# Altium project 407I.PrjPcb
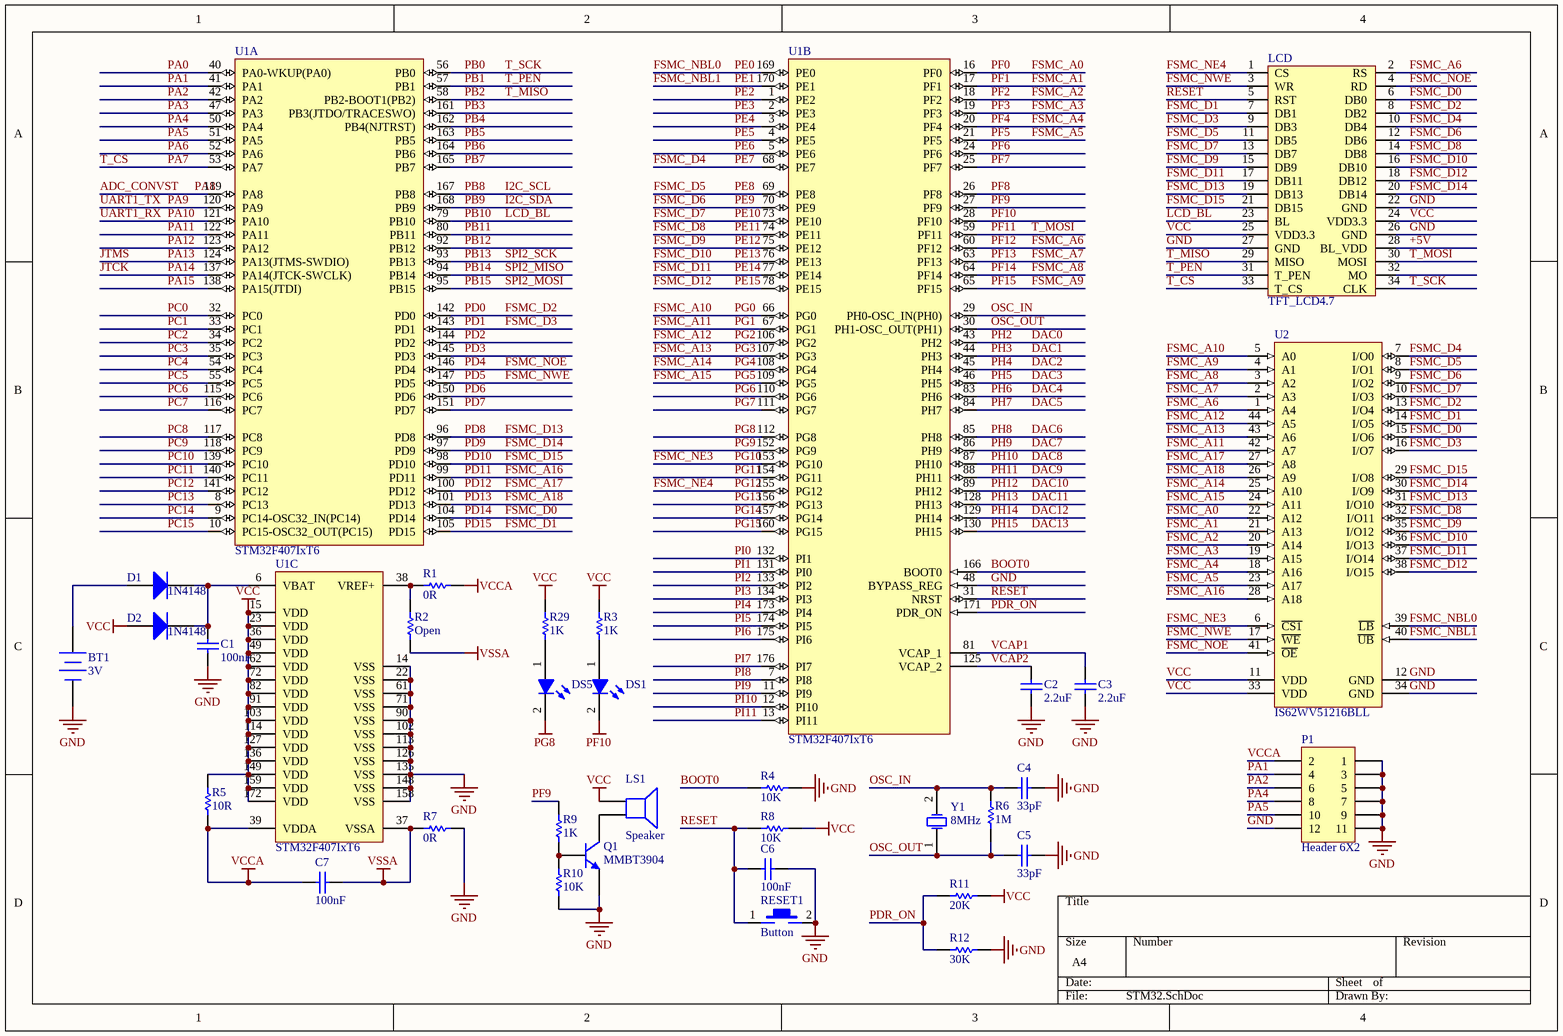
[diagram p0: STM32.SchDoc]
4 sheets, 101 parts. Net scope: global (net labels, ports and power ports of the same name join across sheets).
Board file: F407I.PcbDoc
Sheets:
  STM32.SchDoc
  PORTS.SchDoc
  Power.SchDoc
  CLASS.SchDoc

## Sheet STM32.SchDoc
size A4

### Parts
BT1  3V  [BAT-2]
C1  100nF  [CAPC0603(1608)55_M]
C2  2.2uF  [CAPC0603(1608)55_M]
C3  2.2uF  [CAPC0603(1608)55_M]
C4  33pF  [CAPC0603(1608)55_M]
C5  33pF  [CAPC0603(1608)55_M]
C6  100nF  [CAPC0603(1608)55_M]
C7  100nF  [CAPC0603(1608)55_M]
D1  1N4148  [LL34]
D2  1N4148  [LL34]
DS1  LED-BLUE  [0603LED_BLUE_V]  (value not drawn)
DS5  LED-BLUE  [0603LED_BLUE_V]  (value not drawn)
LCD  TFT_LCD4.7  [DB2*17-3.5]
LS1  Speaker  [Buzzer]
P1  Header 6X2  [HDR2X6]
Q1  MMBT3904  [SOT23_M]
R1  0R  [RESC0603(1608)_M]
R2  Open  [RESC0603(1608)_M]
R3  1K  [RESC0603(1608)_M]
R4  10K  [RESC0603(1608)_M]
R5  10R  [RESC0603(1608)_M]
R6  1M  [RESC0603(1608)_M]
R7  0R  [RESC0603(1608)_M]
R8  10K  [RESC0603(1608)_M]
R9  1K  [RESC0603(1608)_M]
R10  10K  [RESC0603(1608)_M]
R11  20K  [RESC0603(1608)_M]
R12  30K  [RESC0603(1608)_M]
R29  1K  [RESC0603(1608)_M]
RESET1  Button  [Button665]
U1  STM32F407IxT6  [LQFP176]  (parts A,B,C of 3)
U2  IS62WV51216BLL  [TSOP-2-44]
Y1  8MHz  [HC-49S]

### Nets
+5V: LCD.28(BL_VDD)
GND: BT1.2(-) C1.2 C2.1 C3.1 C4.2 C5.2 C6.2 LCD.22(GND) LCD.26(GND) LCD.27(GND) P1.1 P1.3 P1.5 P1.7 P1.9 P1.11 P1.12 Q1.2(E) R4.1 R7.1 R10.1 R12.1 RESET1.2 U1.14(VSS) U1.22(VSS) U1.48(BYPASS_REG) U1.61(VSS) U1.71(VSS) U1.90(VSS) U1.102(VSS) U1.113(VSS) U1.126(VSS) U1.135(VSS) U1.148(VSS) U1.158(VSS) U2.12(GND) U2.34(GND)
PF10: DS1.2(K) U1.28(PF10)
PG8: DS5.2(K) U1.112(PG8)
VCC: D2.2(A) LCD.24(VDD3.3) LCD.25(VDD3.3) LS1.1 R3.2 R5.2 R8.1 R11.1 R29.2 U1.15(VDD) U1.23(VDD) U1.36(VDD) U1.49(VDD) U1.62(VDD) U1.72(VDD) U1.82(VDD) U1.91(VDD) U1.103(VDD) U1.114(VDD) U1.127(VDD) U1.136(VDD) U1.149(VDD) U1.159(VDD) U1.172(VDD) U2.11(VDD) U2.33(VDD)
VCCA: C7.1 P1.2 R1.1 R5.1 U1.39(VDDA)
VSSA: C7.2 R2.1 R7.2 U1.37(VSSA)
ADC_CONVST: U1.119(PA8)  [also labelled PA8]
BOOT0: R4.2 U1.166(BOOT0)
DAC0: U1.43(PH2)  [also labelled PH2]
DAC1: U1.44(PH3)  [also labelled PH3]
DAC2: U1.45(PH4)  [also labelled PH4]
DAC3: U1.46(PH5)  [also labelled PH5]
DAC4: U1.83(PH6)  [also labelled PH6]
DAC5: U1.84(PH7)  [also labelled PH7]
DAC6: U1.85(PH8)  [also labelled PH8]
DAC7: U1.86(PH9)  [also labelled PH9]
DAC8: U1.87(PH10)  [also labelled PH10]
DAC9: U1.88(PH11)  [also labelled PH11]
DAC10: U1.89(PH12)  [also labelled PH12]
DAC11: U1.128(PH13)  [also labelled PH13]
DAC12: U1.129(PH14)  [also labelled PH14]
DAC13: U1.130(PH15)  [also labelled PH15]
FSMC_A0: U1.16(PF0) U2.22(A12)  [also labelled PF0]
FSMC_A1: U1.17(PF1) U2.21(A13)  [also labelled PF1]
FSMC_A2: U1.18(PF2) U2.20(A14)  [also labelled PF2]
FSMC_A3: U1.19(PF3) U2.19(A15)  [also labelled PF3]
FSMC_A4: U1.20(PF4) U2.18(A16)  [also labelled PF4]
FSMC_A5: U1.21(PF5) U2.23(A17)  [also labelled PF5]
FSMC_A6: LCD.2(RS) U1.60(PF12) U2.1(A4)  [also labelled PF12]
FSMC_A7: U1.63(PF13) U2.2(A3)  [also labelled PF13]
FSMC_A8: U1.64(PF14) U2.3(A2)  [also labelled PF14]
FSMC_A9: U1.65(PF15) U2.4(A1)  [also labelled PF15]
FSMC_A10: U1.66(PG0) U2.5(A0)  [also labelled PG0]
FSMC_A11: U1.67(PG1) U2.42(A7)  [also labelled PG1]
FSMC_A12: U1.106(PG2) U2.44(A5)  [also labelled PG2]
FSMC_A13: U1.107(PG3) U2.43(A6)  [also labelled PG3]
FSMC_A14: U1.108(PG4) U2.25(A10)  [also labelled PG4]
FSMC_A15: U1.109(PG5) U2.24(A11)  [also labelled PG5]
FSMC_A16: U1.99(PD11) U2.28(A18)  [also labelled PD11]
FSMC_A17: U1.100(PD12) U2.27(A8)  [also labelled PD12]
FSMC_A18: U1.101(PD13) U2.26(A9)  [also labelled PD13]
FSMC_D0: LCD.6(DB0) U1.104(PD14) U2.15(I/O6)  [also labelled PD14]
FSMC_D1: LCD.7(DB1) U1.105(PD15) U2.14(I/O5)  [also labelled PD15]
FSMC_D2: LCD.8(DB2) U1.142(PD0) U2.13(I/O4)  [also labelled PD0]
FSMC_D3: LCD.9(DB3) U1.143(PD1) U2.16(I/O7)  [also labelled PD1]
FSMC_D4: LCD.10(DB4) U1.68(PE7) U2.7(I/O0)  [also labelled PE7]
FSMC_D5: LCD.11(DB5) U1.69(PE8) U2.8(I/O1)  [also labelled PE8]
FSMC_D6: LCD.12(DB6) U1.70(PE9) U2.9(I/O2)  [also labelled PE9]
FSMC_D7: LCD.13(DB7) U1.73(PE10) U2.10(I/O3)  [also labelled PE10]
FSMC_D8: LCD.14(DB8) U1.74(PE11) U2.32(I/O11)  [also labelled PE11]
FSMC_D9: LCD.15(DB9) U1.75(PE12) U2.35(I/O12)  [also labelled PE12]
FSMC_D10: LCD.16(DB10) U1.76(PE13) U2.36(I/O13)  [also labelled PE13]
FSMC_D11: LCD.17(DB11) U1.77(PE14) U2.37(I/O14)  [also labelled PE14]
FSMC_D12: LCD.18(DB12) U1.78(PE15) U2.38(I/O15)  [also labelled PE15]
FSMC_D13: LCD.19(DB13) U1.96(PD8) U2.31(I/O10)  [also labelled PD8]
FSMC_D14: LCD.20(DB14) U1.97(PD9) U2.30(I/O9)  [also labelled PD9]
FSMC_D15: LCD.21(DB15) U1.98(PD10) U2.29(I/O8)  [also labelled PD10]
FSMC_NBL0: U1.169(PE0) U2.39(~{LB})  [also labelled PE0]
FSMC_NBL1: U1.170(PE1) U2.40(~{UB})  [also labelled PE1]
FSMC_NE3: U1.153(PG10) U2.6(~{CS1})  [also labelled PG10]
FSMC_NE4: LCD.1(CS) U1.155(PG12)  [also labelled PG12]
FSMC_NOE: LCD.4(RD) U1.146(PD4) U2.41(~{OE})  [also labelled PD4]
FSMC_NWE: LCD.3(WR) U1.147(PD5) U2.17(~{WE})  [also labelled PD5]
I2C_SCL: U1.167(PB8)  [also labelled PB8]
I2C_SDA: U1.168(PB9)  [also labelled PB9]
JTCK: U1.137(PA14(JTCK-SWCLK))  [also labelled PA14]
JTMS: U1.124(PA13(JTMS-SWDIO))  [also labelled PA13]
LCD_BL: LCD.23(BL) U1.79(PB10)  [also labelled PB10]
OSC_IN: C4.1 R6.2 U1.29(PH0-OSC_IN(PH0)) Y1.2(OSC2)
OSC_OUT: C5.1 R6.1 U1.30(PH1-OSC_OUT(PH1)) Y1.1(OSC1)
PA0: U1.40(PA0-WKUP(PA0))
PA1: P1.4 U1.41(PA1)
PA2: P1.6 U1.42(PA2)
PA3: U1.47(PA3)
PA4: P1.8 U1.50(PA4)
PA5: P1.10 U1.51(PA5)
PA6: U1.52(PA6)
PA7: LCD.33(T_CS) U1.53(PA7)  [also labelled T_CS]
PA9: U1.120(PA9)  [also labelled UART1_TX]
PA10: U1.121(PA10)  [also labelled UART1_RX]
PA11: U1.122(PA11)
PA12: U1.123(PA12)
PA15: U1.138(PA15(JTDI))
PB0: LCD.34(CLK) U1.56(PB0)  [also labelled T_SCK]
PB1: LCD.31(T_PEN) U1.57(PB1)  [also labelled T_PEN]
PB2: LCD.29(MISO) U1.58(PB2-BOOT1(PB2))  [also labelled T_MISO]
PB3: U1.161(PB3(JTDO/TRACESWO))  [project net DDS_SCLK]
PB4: U1.162(PB4(NJTRST))  [project net DDS_CS]
PB5: U1.163(PB5)  [project net DDS_UP]
PB6: U1.164(PB6)  [project net DDS_P3]
PB7: U1.165(PB7)  [project net DDS_P2]
PB11: U1.80(PB11)
PB12: U1.92(PB12)
PB13: U1.93(PB13)  [also labelled SPI2_SCK]
PB14: U1.94(PB14)  [also labelled SPI2_MISO]
PB15: U1.95(PB15)  [also labelled SPI2_MOSI]
PC0: U1.32(PC0)
PC1: U1.33(PC1)
PC2: U1.34(PC2)
PC3: U1.35(PC3)
PC4: U1.54(PC4)
PC5: U1.55(PC5)
PC6: U1.115(PC6)
PC7: U1.116(PC7)
PC8: U1.117(PC8)
PC9: U1.118(PC9)
PC10: U1.139(PC10)
PC11: U1.140(PC11)
PC12: U1.141(PC12)
PC13: U1.8(PC13)
PC14: U1.9(PC14-OSC32_IN(PC14))
PC15: U1.10(PC15-OSC32_OUT(PC15))
PD2: U1.144(PD2)
PD3: U1.145(PD3)
PD6: U1.150(PD6)
PD7: U1.151(PD7)
PDR_ON: R11.2 R12.2 U1.171(PDR_ON)
PE2: U1.1(PE2)  [project net DDS_RESET]
PE3: U1.2(PE3)  [project net DDS_SDIO2]
PE4: U1.3(PE4)  [project net DDS_SDIO3]
PE5: U1.4(PE5)  [project net DDS_SDIO0]
PE6: U1.5(PE6)  [project net DDS_SDIO1]
PF6: U1.24(PF6)  [project net DDS_P1]
PF7: U1.25(PF7)  [project net DDS_P0]
PF8: U1.26(PF8)
PF9: R9.2 U1.27(PF9)
PF11: LCD.30(MOSI) U1.59(PF11)  [also labelled T_MOSI]
PG6: U1.110(PG6)
PG7: U1.111(PG7)
PG9: U1.152(PG9)
PG11: U1.154(PG11)
PG13: U1.156(PG13)
PG14: U1.157(PG14)
PG15: U1.160(PG15)
PI0: U1.132(PI1)
PI1: U1.131(PI0)
PI2: U1.133(PI2)
PI3: U1.134(PI3)
PI4: U1.173(PI4)
PI5: U1.174(PI5)
PI6: U1.175(PI6)
PI7: U1.176(PI7)
PI8: U1.7(PI8)
PI9: U1.11(PI9)
PI10: U1.12(PI10)
PI11: U1.13(PI11)
RESET: C6.1 LCD.5(RST) R8.2 RESET1.1 U1.31(NRST)
VCAP1: C3.2 U1.81(VCAP_1)
VCAP2: C2.2 U1.125(VCAP_2)
NetBT1_1: BT1.1(+) D1.2(A)
NetC1_1: C1.1 D1.1(K) D2.1(K) U1.6(VBAT)
NetDS1_1: DS1.1(A) R3.1
NetDS5_1: DS5.1(A) R29.1
NetLS1_2: LS1.2 Q1.3(C)
NetQ1_1: Q1.1(B) R9.1 R10.2
NetR1_2: R1.2 R2.2 U1.38(VREF+)

Not connected (* = marked no-connect by the designer): LCD 32(MO)

### Library data of the parts
BT1 = Battery: Multicell Battery; Published: 24-Mar-1999; LatestRevisionDate: 17-Jul-2002; LatestRevisionNote: Re-released for DXP Platform.; PackageReference: BAT-2; Publisher: Altium Limited; PackageDescription: Battery; 2 Leads
C1-C7 = CAP
D1 D2 = Diode: pin to pad: 1>2 2>1
LS1 = Speaker: Loudspeaker; Published: 24-Mar-1999; LatestRevisionDate: 17-Jul-2002; LatestRevisionNote: Re-released for DXP Platform.; PackageReference: PIN2; Publisher: Altium Limited
P1 = Header 6X2: Header, 6-Pin, Dual row; LatestRevisionDate: 17-Jul-2002; LatestRevisionNote: Re-released for DXP Platform.; Publisher: Altium Limited
Q1 = MMBT3904: NPN General Purpose Amplifier; Published: 8-Jun-2000; LatestRevisionDate: 15-Jan-2003; LatestRevisionNote: PCB Footprint 'BCY-W3/D4.7' replaced; DatasheetVersion: 1997; PackageVersion: Sep-1998; PackageReference: TO-92A; Publisher: Altium Limited; PackageDescription: TO, Flat Index; 3 In-Line, Axial Leads; Body Dia. 4.5mm; Leads 0.51 x 0.48 mm (max); ComponentLink1Description: Manufacturer Link; ComponentLink1URL: http://www.fairchildsemi.com/; ComponentLink2Description: Datasheet; ComponentLink2URL: http://www.fairchildsemi.com/ds/2N%2F2N3904.pdf
R1-R12 R29 = RES
Y1 = XTAL: Crystal Oscillator; Published: 8-Jun-2000; LatestRevisionDate: 17-Jul-2002; LatestRevisionNote: Re-released for DXP Platform.; PackageReference: R38; Publisher: Altium Limited; PackageDescription: Crystal, Thru-Hole; 2 Leads; Body 3.1 x 8.2 mm (Dia.xH)

## Sheet PORTS.SchDoc
size A4
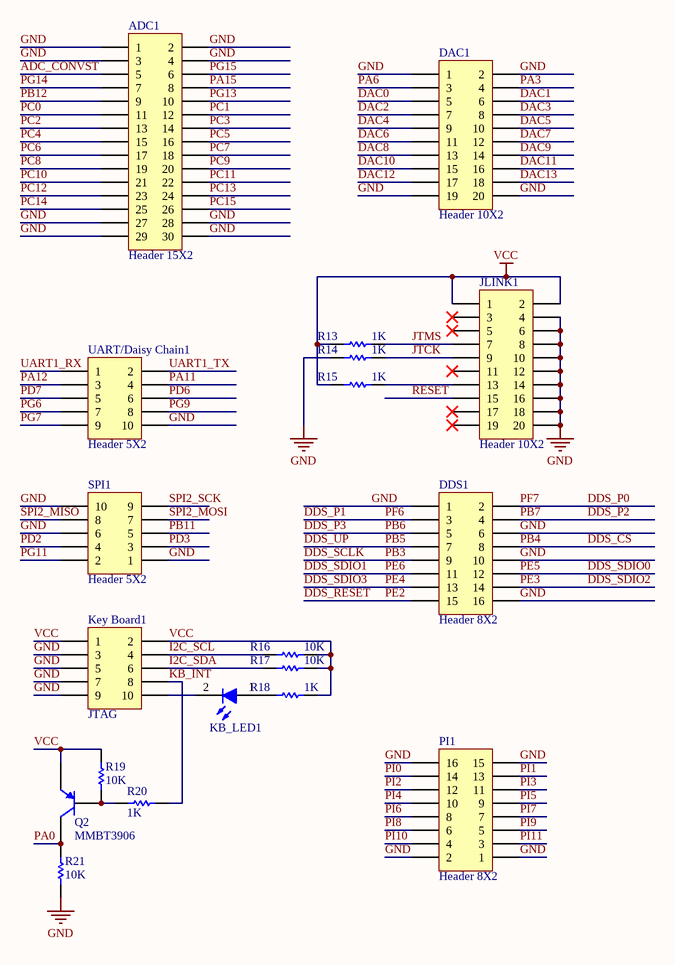
[diagram p1: PORTS.SchDoc]

### Parts
ADC1  Header 15X2  [HEADER15X2]
DAC1  Header 10X2  [HEADER10X2]
DDS1  Header 8X2  [Header8X2]
JLINK1  Header 10X2  [HEADER10X2]
KB_LED1  LED-BLUE  [0603LED_BLUE_V]  (value not drawn)
Key_Board1  JTAG  [HEADER5X2]
PI1  Header 8X2  [HEADER8X2]
Q2  MMBT3906  [SOT23_M]
R13  1K  [RESC0603(1608)_M]
R14  1K  [RESC0603(1608)_M]
R15  1K  [RESC0603(1608)_M]
R16  10K  [RESC0603(1608)_M]
R17  10K  [RESC0603(1608)_M]
R18  1K  [RESC0603(1608)_M]
R19  10K  [RESC0603(1608)_M]
R20  1K  [RESC0603(1608)_M]
R21  10K  [RESC0603(1608)_M]
SPI1  Header 5X2  [HEADER5X2]
UART/Daisy_Chain1  Header 5X2  [HEADER5X2]

### Nets
GND: ADC1.1 ADC1.2 ADC1.3 ADC1.4 ADC1.27 ADC1.28 ADC1.29 ADC1.30 DAC1.1 DAC1.2 DAC1.19 DAC1.20 DDS1.1 DDS1.6 DDS1.10 DDS1.16 JLINK1.4 JLINK1.6 JLINK1.8 JLINK1.10 JLINK1.12 JLINK1.14 JLINK1.16 JLINK1.18 JLINK1.20 Key_Board1.3 Key_Board1.5 Key_Board1.7 Key_Board1.9 PI1.1 PI1.2 PI1.15 PI1.16 R14.2 R21.1 SPI1.1 SPI1.6 SPI1.10 UART/Daisy_Chain1.10
VCC: JLINK1.1 JLINK1.2 Key_Board1.1 Key_Board1.2 Q2.2(E) R13.2 R15.2 R16.1 R17.1 R18.1 R19.2
ADC_CONVST: ADC1.5
DAC0: DAC1.5
DAC1: DAC1.6
DAC2: DAC1.7
DAC3: DAC1.8
DAC4: DAC1.9
DAC5: DAC1.10
DAC6: DAC1.11
DAC7: DAC1.12
DAC8: DAC1.13
DAC9: DAC1.14
DAC10: DAC1.15
DAC11: DAC1.16
DAC12: DAC1.17
DAC13: DAC1.18
DDS_CS: DDS1.8  [also labelled PB4]
DDS_P0: DDS1.2  [also labelled PF7]
DDS_P1: DDS1.3  [also labelled PF6]
DDS_P2: DDS1.4  [also labelled PB7]
DDS_P3: DDS1.5  [also labelled PB6]
DDS_RESET: DDS1.15  [also labelled PE2]
DDS_SCLK: DDS1.9  [also labelled PB3]
DDS_SDIO0: DDS1.12  [also labelled PE5]
DDS_SDIO1: DDS1.11  [also labelled PE6]
DDS_SDIO2: DDS1.14  [also labelled PE3]
DDS_SDIO3: DDS1.13  [also labelled PE4]
DDS_UP: DDS1.7  [also labelled PB5]
I2C_SCL: Key_Board1.4 R16.2
I2C_SDA: Key_Board1.6 R17.2
JTCK: JLINK1.9 R14.1
JTMS: JLINK1.7 R13.1
KB_INT: Key_Board1.8 R20.2
PA0: Q2.3(C) R21.2
PA3: DAC1.4
PA6: DAC1.3
PA11: UART/Daisy_Chain1.4
PA12: UART/Daisy_Chain1.3
PA15: ADC1.8
PB11: SPI1.5
PB12: ADC1.9
PC0: ADC1.11
PC1: ADC1.12
PC2: ADC1.13
PC3: ADC1.14
PC4: ADC1.15
PC5: ADC1.16
PC6: ADC1.17
PC7: ADC1.18
PC8: ADC1.19
PC9: ADC1.20
PC10: ADC1.21
PC11: ADC1.22
PC12: ADC1.23
PC13: ADC1.24
PC14: ADC1.25
PC15: ADC1.26
PD2: SPI1.4
PD3: SPI1.3
PD6: UART/Daisy_Chain1.6
PD7: UART/Daisy_Chain1.5
PG6: UART/Daisy_Chain1.7
PG7: UART/Daisy_Chain1.9
PG9: UART/Daisy_Chain1.8
PG11: SPI1.2
PG13: ADC1.10
PG14: ADC1.7
PG15: ADC1.6
PI0: PI1.14
PI1: PI1.13
PI2: PI1.12
PI3: PI1.11
PI4: PI1.10
PI5: PI1.9
PI6: PI1.8
PI7: PI1.7
PI8: PI1.6
PI9: PI1.5
PI10: PI1.4
PI11: PI1.3
RESET: JLINK1.15
SPI2_MISO: SPI1.8  [project net PB14]
SPI2_MOSI: SPI1.7  [project net PB15]
SPI2_SCK: SPI1.9  [project net PB13]
UART1_RX: UART/Daisy_Chain1.1  [project net PA10]
UART1_TX: UART/Daisy_Chain1.2  [project net PA9]
NetJLINK1_13: JLINK1.13 R15.1
NetKB_LED1_1: KB_LED1.1(A) R18.2
NetKB_LED1_2: KB_LED1.2(K) Key_Board1.10
NetQ2_1: Q2.1(B) R19.1 R20.1

Not connected (* = marked no-connect by the designer): JLINK1 3* 5* 11* 17* 19*

### Library data of the parts
ADC1 = Header 15X2: Header, 15-Pin, Dual row; LatestRevisionDate: 17-Jul-2002; LatestRevisionNote: Re-released for DXP Platform.; Publisher: Altium Limited
DAC1 JLINK1 = Header 10X2: Header, 10-Pin, Dual row; LatestRevisionDate: 17-Jul-2002; LatestRevisionNote: Re-released for DXP Platform.; Publisher: Altium Limited
DDS1 PI1 = Header 8X2: Header, 8-Pin, Dual row; LatestRevisionDate: 17-Jul-2002; LatestRevisionNote: Re-released for DXP Platform.; Publisher: Altium Limited
Key_Board1 = Header 5X2: Header, 5-Pin, Dual row; Manufacturer: Generic Components; Class: Connector
Q2 = MMBT3906: PNP General Purpose Amplifier; Published: 8-Jun-2000; LatestRevisionDate: 15-Jan-2003; LatestRevisionNote: PCB Footprint 'BCY-W3/D4.7' replaced; DatasheetVersion: 1997; PackageVersion: Sep-1998; PackageReference: TO-92A; Publisher: Altium Limited; PackageDescription: TO, Flat Index; 3 In-Line, Axial Leads; Body Dia. 4.5mm; Leads 0.51 x 0.48 mm (max); ComponentLink1Description: Manufacturer Link; ComponentLink1URL: http://www.fairchildsemi.com/; ComponentLink2Description: Datasheet; ComponentLink2URL: http://www.fairchildsemi.com/ds/2N%2F2N3906.pdf
R13-R21 = RES
SPI1 UART/Daisy_Chain1 = Header 5X2: Header, 5-Pin, Dual row; LatestRevisionDate: 17-Jul-2002; LatestRevisionNote: Re-released for DXP Platform.; Publisher: Altium Limited

## Sheet Power.SchDoc
size A4
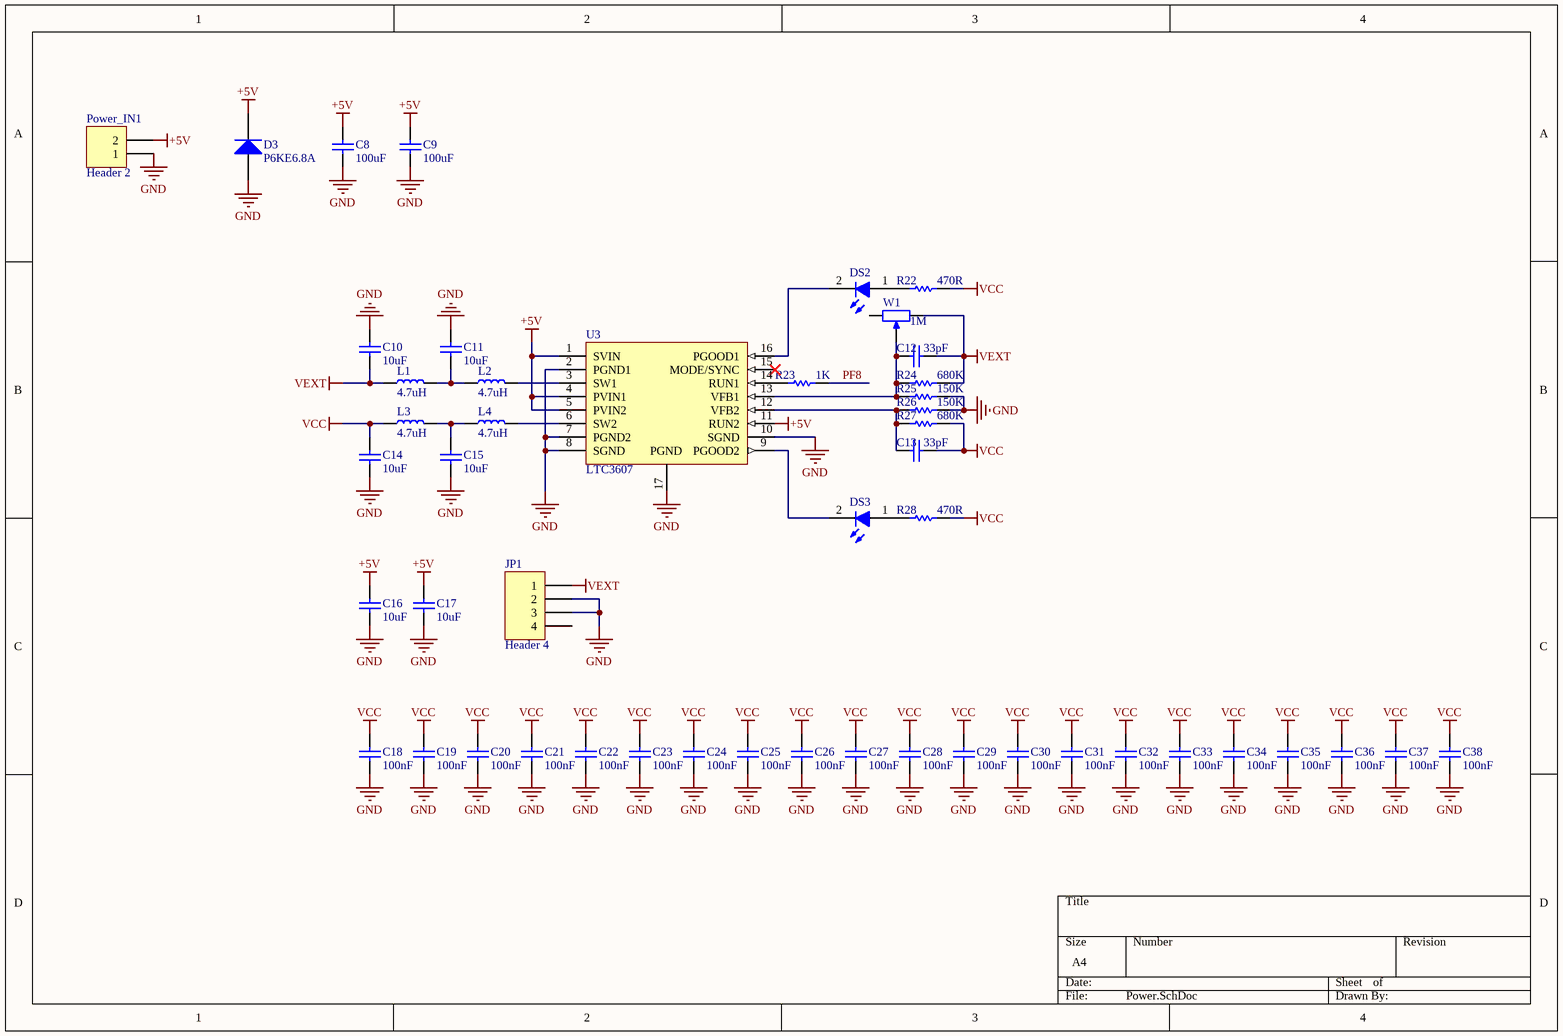
[diagram p2: Power.SchDoc]

### Parts
C8  100uF  [CAPC3225]
C9  100uF  [CAPC3225]
C10  10uF  [CAPC0805(2012)75_M]
C11  10uF  [CAPC0805(2012)75_M]
C12  33pF  [CAPC0603(1608)55_M]
C13  33pF  [CAPC0603(1608)55_M]
C14  10uF  [CAPC0805(2012)75_M]
C15  10uF  [CAPC0805(2012)75_M]
C16  10uF  [CAPC0805(2012)75_M]
C17  10uF  [CAPC0805(2012)75_M]
C18  100nF  [CAPC0603(1608)55_M]
C19  100nF  [CAPC0603(1608)55_M]
C20  100nF  [CAPC0603(1608)55_M]
C21  100nF  [CAPC0603(1608)55_M]
C22  100nF  [CAPC0603(1608)55_M]
C23  100nF  [CAPC0603(1608)55_M]
C24  100nF  [CAPC0603(1608)55_M]
C25  100nF  [CAPC0603(1608)55_M]
C26  100nF  [CAPC0603(1608)55_M]
C27  100nF  [CAPC0603(1608)55_M]
C28  100nF  [CAPC0603(1608)55_M]
C29  100nF  [CAPC0603(1608)55_M]
C30  100nF  [CAPC0603(1608)55_M]
C31  100nF  [CAPC0603(1608)55_M]
C32  100nF  [CAPC0603(1608)55_M]
C33  100nF  [CAPC0603(1608)55_M]
C34  100nF  [CAPC0603(1608)55_M]
C35  100nF  [CAPC0603(1608)55_M]
C36  100nF  [CAPC0603(1608)55_M]
C37  100nF  [CAPC0603(1608)55_M]
C38  100nF  [CAPC0603(1608)55_M]
D3  P6KE6.8A  [DO-214AC]
DS2  LED-BLUE  [0603LED_BLUE_V]  (value not drawn)
DS3  LED-BLUE  [0603LED_BLUE_V]  (value not drawn)
JP1  Header 4  [3.96-4-A]
L1  4.7uH  [CD32]
L2  4.7uH  [CD32]
L3  4.7uH  [CD32]
L4  4.7uH  [CD32]
Power_IN1  Header 2  [VH3.96-2-AW]
R22  470R  [RESC0603(1608)_M]
R23  1K  [RESC0603(1608)_M]
R24  680K  [RESC0603(1608)_M]
R25  150K  [RESC0603(1608)_M]
R26  150K  [RESC0603(1608)_M]
R27  680K  [RESC0603(1608)_M]
R28  470R  [RESC0603(1608)_M]
U3  LTC3607  [MSE16]
W1  1M  [VR5]

### Nets
+5V: C8.2 C9.2 C16.2 C17.2 D3.1(K) Power_IN1.2 U3.1(SVIN) U3.4(PVIN1) U3.5(PVIN2) U3.11(RUN2)
GND: C8.1 C9.1 C10.2 C11.2 C14.2 C15.2 C16.1 C17.1 C18.1 C19.1 C20.1 C21.1 C22.1 C23.1 C24.1 C25.1 C26.1 C27.1 C28.1 C29.1 C30.1 C31.1 C32.1 C33.1 C34.1 C35.1 C36.1 C37.1 C38.1 D3.2(A) JP1.2 JP1.3 Power_IN1.1 R25.1 R26.1 U3.2(PGND1) U3.7(PGND2) U3.8(SGND) U3.10(SGND) U3.17(PGND)
VCC: C13.2 C14.1 C18.2 C19.2 C20.2 C21.2 C22.2 C23.2 C24.2 C25.2 C26.2 C27.2 C28.2 C29.2 C30.2 C31.2 C32.2 C33.2 C34.2 C35.2 C36.2 C37.2 C38.2 L3.1 R22.1 R27.1 R28.1
VEXT: C10.1 C12.2 JP1.1 L1.1 R24.1 W1.3(BOT)
PF8: R23.1
NetC11_1: C11.1 L1.2 L2.1
NetC12_1: C12.1 R24.2 R25.2 U3.13(VFB1) W1.2(TAP)
NetC13_1: C13.1 R26.2 R27.2 U3.12(VFB2)
NetC15_1: C15.1 L3.2 L4.1
NetDS2_1: DS2.1(A) R22.2
NetDS2_2: DS2.2(K) U3.16(PGOOD1)
NetDS3_1: DS3.1(A) R28.2
NetDS3_2: DS3.2(K) U3.9(PGOOD2)
NetL2_2: L2.2 U3.3(SW1)
NetL4_2: L4.2 U3.6(SW2)
NetR23_2: R23.2 U3.14(RUN1)

Not connected (* = marked no-connect by the designer): JP1 4; U3 15(MODE/SYNC)*; W1 1(TOP)

### Library data of the parts
C8-C38 = CAP
D3 = Diode: pin to pad: 1>2 2>1
JP1 = Header 4: Header, 4-Pin; Manufacturer: Generic Components; Class: Connector
L1-L4 = Inductor
Power_IN1 = Header 2: Header, 2-Pin; LatestRevisionDate: 17-Jul-2002; LatestRevisionNote: Re-released for DXP Platform.; Publisher: Altium Limited
R22-R28 = RES
W1 = RPot2: Potentiometer; Manufacturer: Generic Components; Class: Passive; Set Position: 0.5; Value: 1K; Published: 08/06/2000; Publisher: Altium Hobart Technology Centre; SubClass: Potentiometer

## Sheet CLASS.SchDoc
size A4
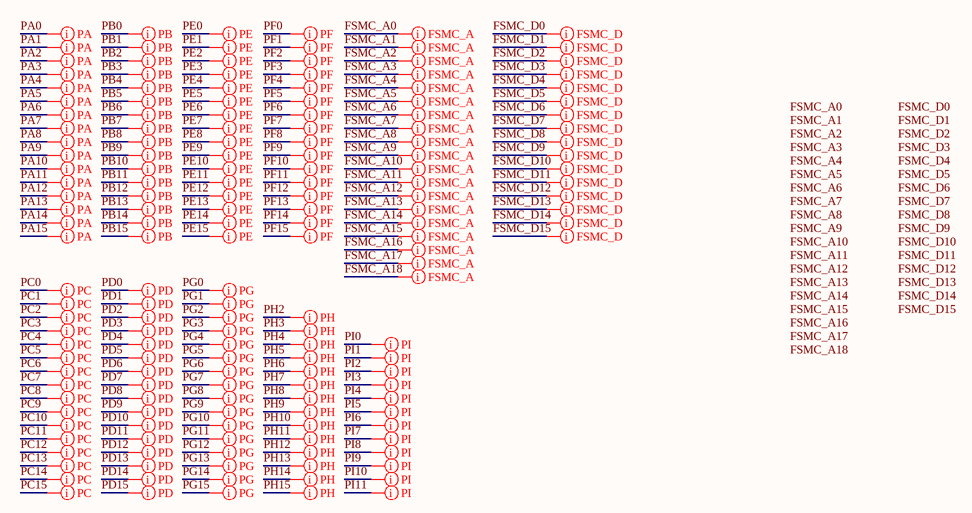
[diagram p3: CLASS.SchDoc]

### Layout directives
net class PA: ADC_CONVST, JTCK, JTMS, PA0, PA1, PA2, PA3, PA4, PA5, PA6, PA7, PA9, PA10, PA11, PA12, PA15
net class PC: PC0, PC1, PC2, PC3, PC4, PC5, PC6, PC7, PC8, PC9, PC10, PC11, PC12, PC13, PC14, PC15
net class PB: DDS_CS, DDS_P2, DDS_P3, DDS_SCLK, DDS_UP, I2C_SCL, I2C_SDA, LCD_BL, PB0, PB1, PB2, PB11, PB12, PB13, PB14, PB15
net class PE: DDS_RESET, DDS_SDIO0, DDS_SDIO1, DDS_SDIO2, DDS_SDIO3, FSMC_D4, FSMC_D5, FSMC_D6, FSMC_D7, FSMC_D8, FSMC_D9, FSMC_D10, FSMC_D11, FSMC_D12, FSMC_NBL0, FSMC_NBL1
net class PF: DDS_P0, DDS_P1, FSMC_A0, FSMC_A1, FSMC_A2, FSMC_A3, FSMC_A4, FSMC_A5, FSMC_A6, FSMC_A7, FSMC_A8, FSMC_A9, PF8, PF9, PF10, PF11
net class PD: FSMC_A16, FSMC_A17, FSMC_A18, FSMC_D0, FSMC_D1, FSMC_D2, FSMC_D3, FSMC_D13, FSMC_D14, FSMC_D15, FSMC_NOE, FSMC_NWE, PD2, PD3, PD6, PD7
net class PG: FSMC_A10, FSMC_A11, FSMC_A12, FSMC_A13, FSMC_A14, FSMC_A15, FSMC_NE3, FSMC_NE4, PG6, PG7, PG8, PG9, PG11, PG13, PG14, PG15
net class PH: DAC0, DAC1, DAC2, DAC3, DAC4, DAC5, DAC6, DAC7, DAC8, DAC9, DAC10, DAC11, DAC12, DAC13
net class FSMC_A: FSMC_A0, FSMC_A1, FSMC_A2, FSMC_A3, FSMC_A4, FSMC_A5, FSMC_A6, FSMC_A7, FSMC_A8, FSMC_A9, FSMC_A10, FSMC_A11, FSMC_A12, FSMC_A13, FSMC_A14, FSMC_A15, FSMC_A16, FSMC_A17, FSMC_A18
net class FSMC_D: FSMC_D0, FSMC_D1, FSMC_D2, FSMC_D3, FSMC_D4, FSMC_D5, FSMC_D6, FSMC_D7, FSMC_D8, FSMC_D9, FSMC_D10, FSMC_D11, FSMC_D12, FSMC_D13, FSMC_D14, FSMC_D15
net class PI: PI0, PI1, PI2, PI3, PI4, PI5, PI6, PI7, PI8, PI9, PI10, PI11

### Notes on the sheet
- Labels drawn without touching a wire or pin: FSMC_A0, FSMC_A1, FSMC_A2, FSMC_A3, FSMC_A4, FSMC_A5, FSMC_A6, FSMC_A7, FSMC_A8, FSMC_A9, FSMC_A10, FSMC_A11, FSMC_A12, FSMC_A13, FSMC_A14, FSMC_A15, FSMC_A16, FSMC_A17, FSMC_A18, FSMC_D0, FSMC_D1, FSMC_D2, FSMC_D3, FSMC_D4, FSMC_D5, FSMC_D6, FSMC_D7, FSMC_D8, FSMC_D9, FSMC_D10, FSMC_D11, FSMC_D12, FSMC_D13, FSMC_D14, FSMC_D15

## Nets that join several sheets
+5V: STM32 (LCD.28), Power (10 pins)
GND: STM32 (37 pins), PORTS (39 pins), Power (40 pins)
VCC: STM32 (26 pins), PORTS (11 pins), Power (27 pins)
ADC_CONVST: STM32 (U1.119), PORTS (ADC1.5)
DAC0: STM32 (U1.43), PORTS (DAC1.5)
DAC1: STM32 (U1.44), PORTS (DAC1.6)
DAC2: STM32 (U1.45), PORTS (DAC1.7)
DAC3: STM32 (U1.46), PORTS (DAC1.8)
DAC4: STM32 (U1.83), PORTS (DAC1.9)
DAC5: STM32 (U1.84), PORTS (DAC1.10)
DAC6: STM32 (U1.85), PORTS (DAC1.11)
DAC7: STM32 (U1.86), PORTS (DAC1.12)
DAC8: STM32 (U1.87), PORTS (DAC1.13)
DAC9: STM32 (U1.88), PORTS (DAC1.14)
DAC10: STM32 (U1.89), PORTS (DAC1.15)
DAC11: STM32 (U1.128), PORTS (DAC1.16)
DAC12: STM32 (U1.129), PORTS (DAC1.17)
DAC13: STM32 (U1.130), PORTS (DAC1.18)
DDS_CS: STM32 (U1.162), PORTS (DDS1.8)
DDS_P0: STM32 (U1.25), PORTS (DDS1.2)
DDS_P1: STM32 (U1.24), PORTS (DDS1.3)
DDS_P2: STM32 (U1.165), PORTS (DDS1.4)
DDS_P3: STM32 (U1.164), PORTS (DDS1.5)
DDS_RESET: STM32 (U1.1), PORTS (DDS1.15)
DDS_SCLK: STM32 (U1.161), PORTS (DDS1.9)
DDS_SDIO0: STM32 (U1.4), PORTS (DDS1.12)
DDS_SDIO1: STM32 (U1.5), PORTS (DDS1.11)
DDS_SDIO2: STM32 (U1.2), PORTS (DDS1.14)
DDS_SDIO3: STM32 (U1.3), PORTS (DDS1.13)
DDS_UP: STM32 (U1.163), PORTS (DDS1.7)
I2C_SCL: STM32 (U1.167), PORTS (Key_Board1.4 R16.2)
I2C_SDA: STM32 (U1.168), PORTS (Key_Board1.6 R17.2)
JTCK: STM32 (U1.137), PORTS (JLINK1.9 R14.1)
JTMS: STM32 (U1.124), PORTS (JLINK1.7 R13.1)
PA0: STM32 (U1.40), PORTS (Q2.3 R21.2)
PA3: STM32 (U1.47), PORTS (DAC1.4)
PA6: STM32 (U1.52), PORTS (DAC1.3)
PA9: STM32 (U1.120), PORTS (UART/Daisy_Chain1.2)
PA10: STM32 (U1.121), PORTS (UART/Daisy_Chain1.1)
PA11: STM32 (U1.122), PORTS (UART/Daisy_Chain1.4)
PA12: STM32 (U1.123), PORTS (UART/Daisy_Chain1.3)
PA15: STM32 (U1.138), PORTS (ADC1.8)
PB11: STM32 (U1.80), PORTS (SPI1.5)
PB12: STM32 (U1.92), PORTS (ADC1.9)
PB13: STM32 (U1.93), PORTS (SPI1.9)
PB14: STM32 (U1.94), PORTS (SPI1.8)
PB15: STM32 (U1.95), PORTS (SPI1.7)
PC0: STM32 (U1.32), PORTS (ADC1.11)
PC1: STM32 (U1.33), PORTS (ADC1.12)
PC2: STM32 (U1.34), PORTS (ADC1.13)
PC3: STM32 (U1.35), PORTS (ADC1.14)
PC4: STM32 (U1.54), PORTS (ADC1.15)
PC5: STM32 (U1.55), PORTS (ADC1.16)
PC6: STM32 (U1.115), PORTS (ADC1.17)
PC7: STM32 (U1.116), PORTS (ADC1.18)
PC8: STM32 (U1.117), PORTS (ADC1.19)
PC9: STM32 (U1.118), PORTS (ADC1.20)
PC10: STM32 (U1.139), PORTS (ADC1.21)
PC11: STM32 (U1.140), PORTS (ADC1.22)
PC12: STM32 (U1.141), PORTS (ADC1.23)
PC13: STM32 (U1.8), PORTS (ADC1.24)
PC14: STM32 (U1.9), PORTS (ADC1.25)
PC15: STM32 (U1.10), PORTS (ADC1.26)
PD2: STM32 (U1.144), PORTS (SPI1.4)
PD3: STM32 (U1.145), PORTS (SPI1.3)
PD6: STM32 (U1.150), PORTS (UART/Daisy_Chain1.6)
PD7: STM32 (U1.151), PORTS (UART/Daisy_Chain1.5)
PF8: STM32 (U1.26), Power (R23.1)
PG6: STM32 (U1.110), PORTS (UART/Daisy_Chain1.7)
PG7: STM32 (U1.111), PORTS (UART/Daisy_Chain1.9)
PG9: STM32 (U1.152), PORTS (UART/Daisy_Chain1.8)
PG11: STM32 (U1.154), PORTS (SPI1.2)
PG13: STM32 (U1.156), PORTS (ADC1.10)
PG14: STM32 (U1.157), PORTS (ADC1.7)
PG15: STM32 (U1.160), PORTS (ADC1.6)
PI0: STM32 (U1.132), PORTS (PI1.14)
PI1: STM32 (U1.131), PORTS (PI1.13)
PI2: STM32 (U1.133), PORTS (PI1.12)
PI3: STM32 (U1.134), PORTS (PI1.11)
PI4: STM32 (U1.173), PORTS (PI1.10)
PI5: STM32 (U1.174), PORTS (PI1.9)
PI6: STM32 (U1.175), PORTS (PI1.8)
PI7: STM32 (U1.176), PORTS (PI1.7)
PI8: STM32 (U1.7), PORTS (PI1.6)
PI9: STM32 (U1.11), PORTS (PI1.5)
PI10: STM32 (U1.12), PORTS (PI1.4)
PI11: STM32 (U1.13), PORTS (PI1.3)
RESET: STM32 (5 pins), PORTS (JLINK1.15)